# Altium schematic sheet KLZ.SchDoc
size A3
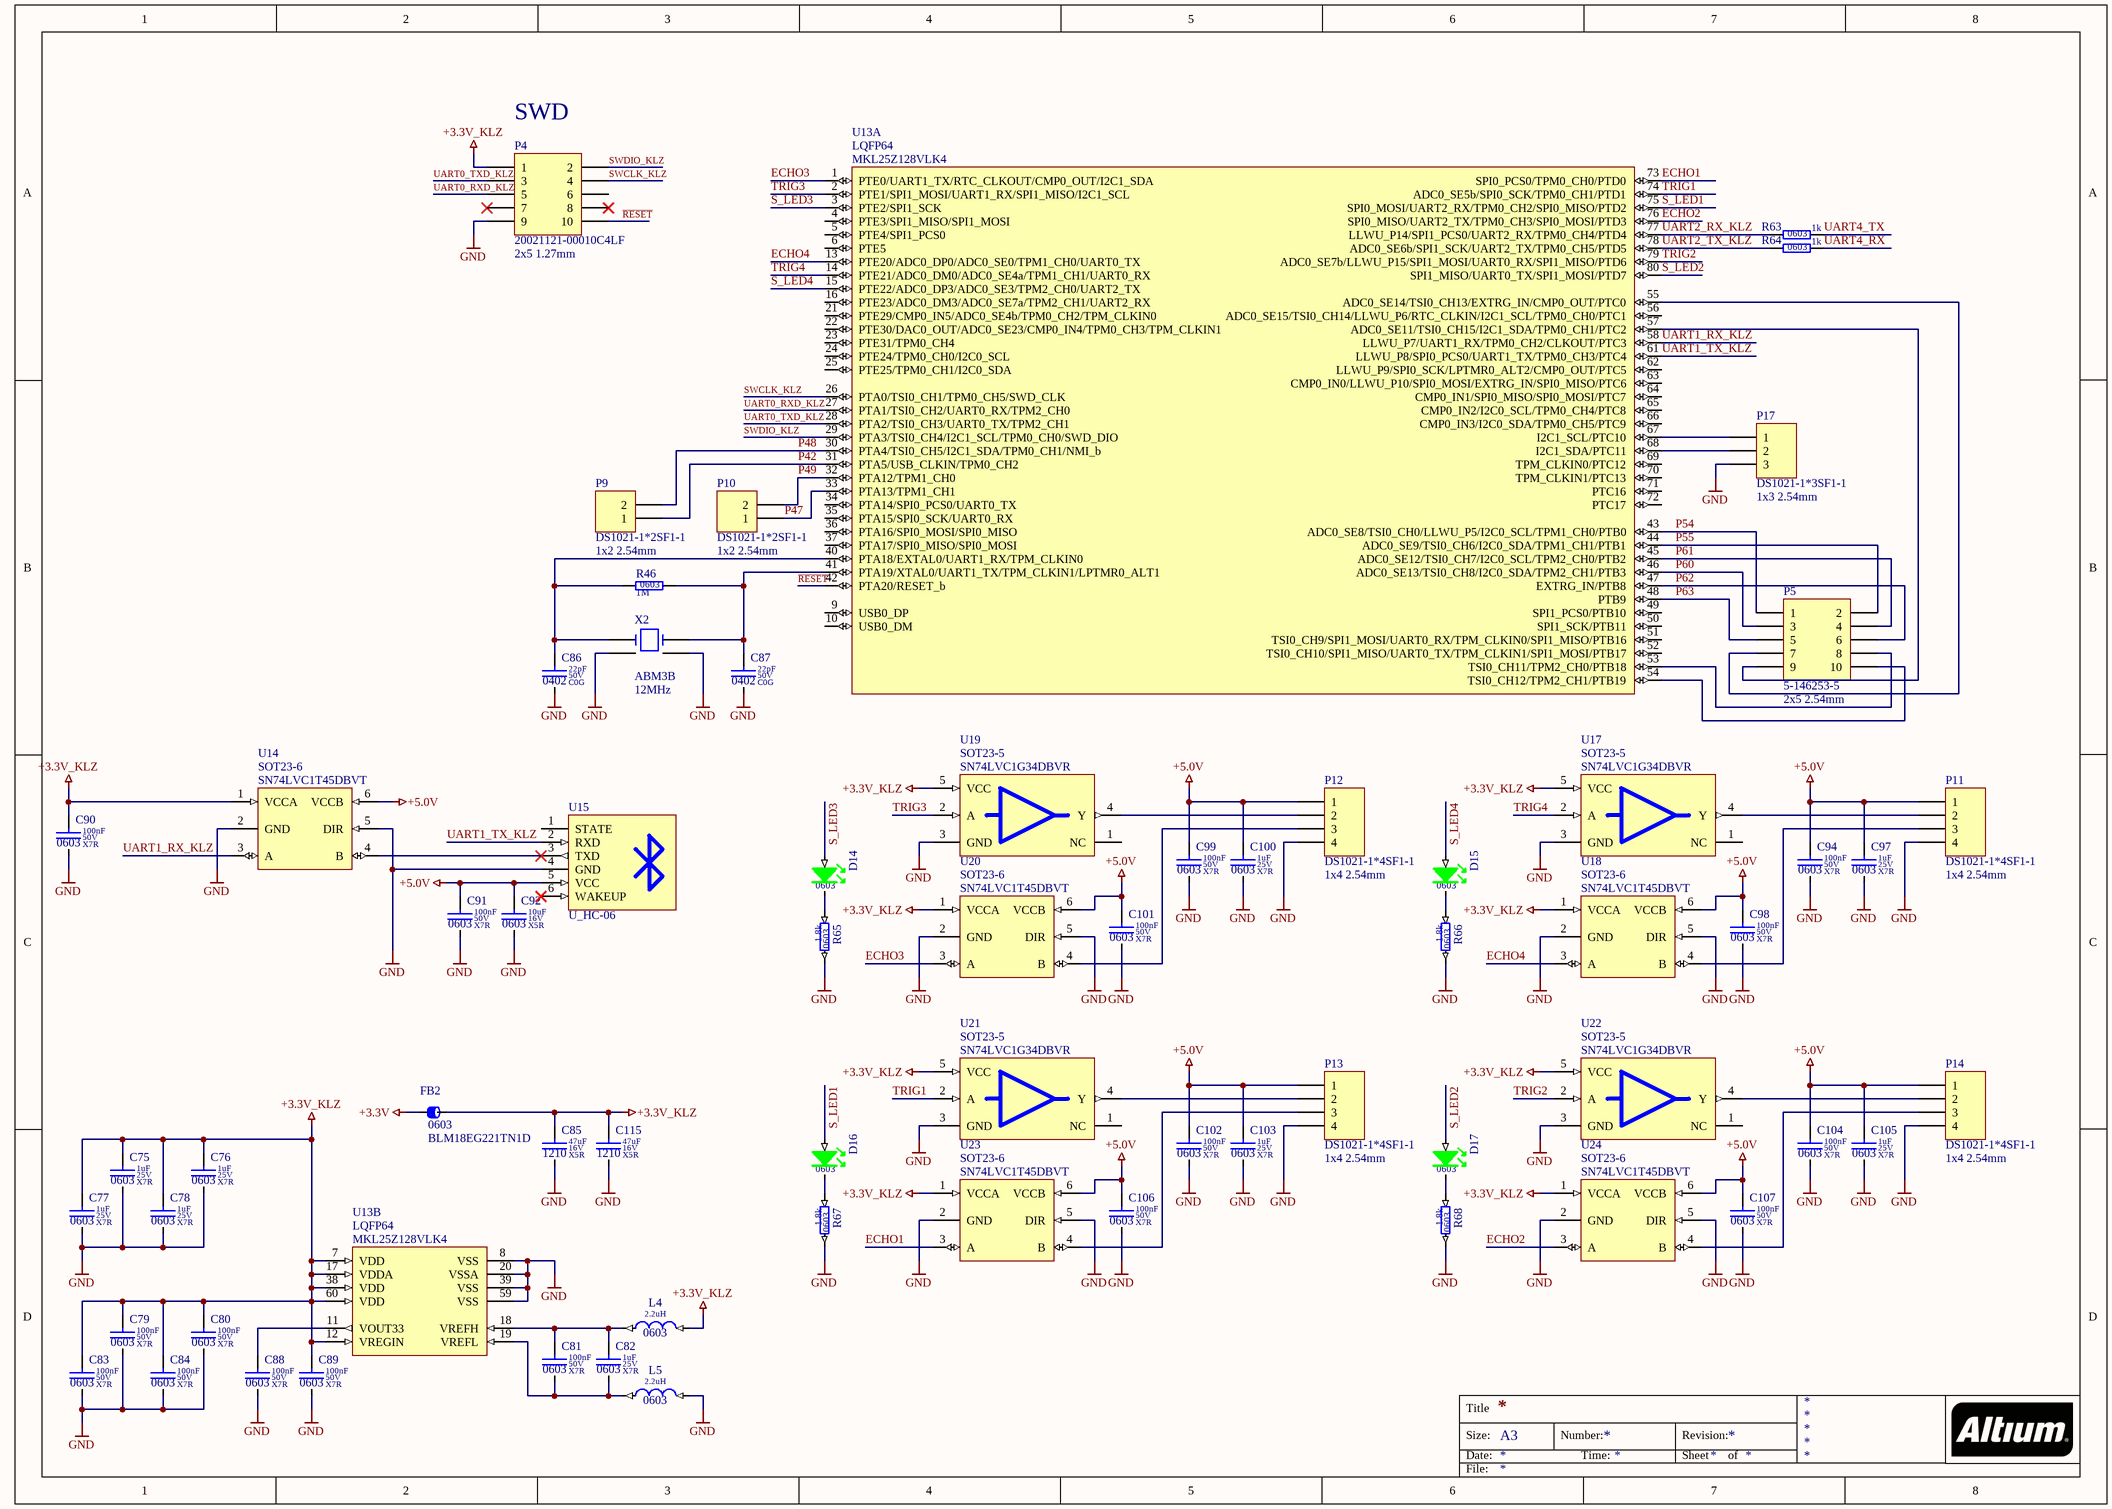
[diagram p0: KLZ.SchDoc]

## Parts
C75  value 1uF  Dielectric: X7R  Voltage: 25V  SCH_Footprint: 0603  [C_0603_1608]  (hidden comment: Ceramic X7R)
C76  value 1uF  Dielectric: X7R  Voltage: 25V  SCH_Footprint: 0603  [C_0603_1608]  (hidden comment: Ceramic X7R)
C77  value 1uF  Dielectric: X7R  Voltage: 25V  SCH_Footprint: 0603  [C_0603_1608]  (hidden comment: Ceramic X7R)
C78  value 1uF  Dielectric: X7R  Voltage: 25V  SCH_Footprint: 0603  [C_0603_1608]  (hidden comment: Ceramic X7R)
C79  value 100nF  Dielectric: X7R  Voltage: 50V  SCH_Footprint: 0603  [C_0603_1608]  (hidden comment: Ceramic X7R)
C80  value 100nF  Dielectric: X7R  Voltage: 50V  SCH_Footprint: 0603  [C_0603_1608]  (hidden comment: Ceramic X7R)
C81  value 100nF  Dielectric: X7R  Voltage: 50V  SCH_Footprint: 0603  [C_0603_1608]  (hidden comment: Ceramic X7R)
C82  value 1uF  Dielectric: X7R  Voltage: 25V  SCH_Footprint: 0603  [C_0603_1608]  (hidden comment: Ceramic X7R)
C83  value 100nF  Dielectric: X7R  Voltage: 50V  SCH_Footprint: 0603  [C_0603_1608]  (hidden comment: Ceramic X7R)
C84  value 100nF  Dielectric: X7R  Voltage: 50V  SCH_Footprint: 0603  [C_0603_1608]  (hidden comment: Ceramic X7R)
C85  value 47uF  Dielectric: X5R  Voltage: 16V  SCH_Footprint: 1210  [C_1210_3225]  (hidden comment: Ceramic X5R)
C86  value 22pF  Dielectric: C0G  Voltage: 50V  SCH_Footprint: 0402  [C_0402_1005]  (hidden comment: Ceramic C0G)
C87  value 22pF  Dielectric: C0G  Voltage: 50V  SCH_Footprint: 0402  [C_0402_1005]  (hidden comment: Ceramic C0G)
C88  value 100nF  Dielectric: X7R  Voltage: 50V  SCH_Footprint: 0603  [C_0603_1608]  (hidden comment: Ceramic X7R)
C89  value 100nF  Dielectric: X7R  Voltage: 50V  SCH_Footprint: 0603  [C_0603_1608]  (hidden comment: Ceramic X7R)
C90  value 100nF  Dielectric: X7R  Voltage: 50V  SCH_Footprint: 0603  [C_0603_1608]  (hidden comment: Ceramic X7R)
C91  value 100nF  Dielectric: X7R  Voltage: 50V  SCH_Footprint: 0603  [C_0603_1608]  (hidden comment: Ceramic X7R)
C92  value 10uF  Dielectric: X5R  Voltage: 16V  SCH_Footprint: 0603  [C_0603_1608]  (hidden comment: Ceramic X5R)
C94  value 100nF  Dielectric: X7R  Voltage: 50V  SCH_Footprint: 0603  [C_0603_1608]  (hidden comment: Ceramic X7R)
C97  value 1uF  Dielectric: X7R  Voltage: 25V  SCH_Footprint: 0603  [C_0603_1608]  (hidden comment: Ceramic X7R)
C98  value 100nF  Dielectric: X7R  Voltage: 50V  SCH_Footprint: 0603  [C_0603_1608]  (hidden comment: Ceramic X7R)
C99  value 100nF  Dielectric: X7R  Voltage: 50V  SCH_Footprint: 0603  [C_0603_1608]  (hidden comment: Ceramic X7R)
C100  value 1uF  Dielectric: X7R  Voltage: 25V  SCH_Footprint: 0603  [C_0603_1608]  (hidden comment: Ceramic X7R)
C101  value 100nF  Dielectric: X7R  Voltage: 50V  SCH_Footprint: 0603  [C_0603_1608]  (hidden comment: Ceramic X7R)
C102  value 100nF  Dielectric: X7R  Voltage: 50V  SCH_Footprint: 0603  [C_0603_1608]  (hidden comment: Ceramic X7R)
C103  value 1uF  Dielectric: X7R  Voltage: 25V  SCH_Footprint: 0603  [C_0603_1608]  (hidden comment: Ceramic X7R)
C104  value 100nF  Dielectric: X7R  Voltage: 50V  SCH_Footprint: 0603  [C_0603_1608]  (hidden comment: Ceramic X7R)
C105  value 1uF  Dielectric: X7R  Voltage: 25V  SCH_Footprint: 0603  [C_0603_1608]  (hidden comment: Ceramic X7R)
C106  value 100nF  Dielectric: X7R  Voltage: 50V  SCH_Footprint: 0603  [C_0603_1608]  (hidden comment: Ceramic X7R)
C107  value 100nF  Dielectric: X7R  Voltage: 50V  SCH_Footprint: 0603  [C_0603_1608]  (hidden comment: Ceramic X7R)
C115  value 47uF  Dielectric: X5R  Voltage: 16V  SCH_Footprint: 1210  [C_1210_3225]  (hidden comment: Ceramic X5R)
D14  SCH_Footprint: 0603  [OL_0603_1608]  (hidden comment: OL_G)
D15  SCH_Footprint: 0603  [OL_0603_1608]  (hidden comment: OL_G)
D16  SCH_Footprint: 0603  [OL_0603_1608]  (hidden comment: OL_G)
D17  SCH_Footprint: 0603  [OL_0603_1608]  (hidden comment: OL_G)
FB2  value BLM18EG221TN1D  SCH_Footprint: 0603  [FB_0603_1608]  (hidden comment: Ferrite bead)
L4  value 2.2uH  SCH_Footprint: 0603  [L_0603_1608]  (hidden comment: Inductor)
L5  value 2.2uH  SCH_Footprint: 0603  [L_0603_1608]  (hidden comment: Inductor)
P4  value 20021121-00010C4LF  SCH_Footprint: 2x5 1.27mm  [P_HEADER_2x5_1.27]  (hidden comment: Jtag)
P5  value 5-146253-5  SCH_Footprint: 2x5 2.54mm  [P_HEADER_2x5_2.54]  (hidden comment: Goldpin)
P9  value DS1021-1*2SF1-1  SCH_Footprint: 1x2 2.54mm  [P_HEADER_1x2_2.54]  (hidden comment: Goldpin)
P10  value DS1021-1*2SF1-1  SCH_Footprint: 1x2 2.54mm  [P_HEADER_1x2_2.54]  (hidden comment: Goldpin)
P11  value DS1021-1*4SF1-1  SCH_Footprint: 1x4 2.54mm  [P_HEADER_1x4_2.54]  (hidden comment: Goldpin)
P12  value DS1021-1*4SF1-1  SCH_Footprint: 1x4 2.54mm  [P_HEADER_1x4_2.54]  (hidden comment: Goldpin)
P13  value DS1021-1*4SF1-1  SCH_Footprint: 1x4 2.54mm  [P_HEADER_1x4_2.54]  (hidden comment: Goldpin)
P14  value DS1021-1*4SF1-1  SCH_Footprint: 1x4 2.54mm  [P_HEADER_1x4_2.54]  (hidden comment: Goldpin)
P17  value DS1021-1*3SF1-1  SCH_Footprint: 1x3 2.54mm  [P_HEADER_1x3_2.54]  (hidden comment: Goldpin)
R46  value 1M  SCH_Footprint: 0603  [R_0603_1608]  (hidden comment: Resistor)
R63  value 1k  SCH_Footprint: 0603  [R_0603_1608]  (hidden comment: Resistor)
R64  value 1k  SCH_Footprint: 0603  [R_0603_1608]  (hidden comment: Resistor)
R65  value 1.8k  SCH_Footprint: 0603  [R_0603_1608]  (hidden comment: Resistor)
R66  value 1.8k  SCH_Footprint: 0603  [R_0603_1608]  (hidden comment: Resistor)
R67  value 1.8k  SCH_Footprint: 0603  [R_0603_1608]  (hidden comment: Resistor)
R68  value 1.8k  SCH_Footprint: 0603  [R_0603_1608]  (hidden comment: Resistor)
U13  SCH_Footprint: LQFP64  [LQFP80_12x12]  (hidden comment: MKL25Z128VLK4)  (parts A,B of 2)
U14  value SN74LVC1T45DBVT  SCH_Footprint: SOT23-6  [SOT23-6_SC74A_SOT753]  (hidden comment: Single-Bit Dual-Supply Bus Transceiver)
U15  U_HC-06  [BT_HC-06]
U17  value SN74LVC1G34DBVR  SCH_Footprint: SOT23-5  [SOT23-5_SC74A_SOT753_M]  (hidden comment: Single Buffer Gate)
U18  value SN74LVC1T45DBVT  SCH_Footprint: SOT23-6  [SOT23-6_SC74A_SOT753]  (hidden comment: Single-Bit Dual-Supply Bus Transceiver)
U19  value SN74LVC1G34DBVR  SCH_Footprint: SOT23-5  [SOT23-5_SC74A_SOT753_M]  (hidden comment: Single Buffer Gate)
U20  value SN74LVC1T45DBVT  SCH_Footprint: SOT23-6  [SOT23-6_SC74A_SOT753]  (hidden comment: Single-Bit Dual-Supply Bus Transceiver)
U21  value SN74LVC1G34DBVR  SCH_Footprint: SOT23-5  [SOT23-5_SC74A_SOT753_M]  (hidden comment: Single Buffer Gate)
U22  value SN74LVC1G34DBVR  SCH_Footprint: SOT23-5  [SOT23-5_SC74A_SOT753_M]  (hidden comment: Single Buffer Gate)
U23  value SN74LVC1T45DBVT  SCH_Footprint: SOT23-6  [SOT23-6_SC74A_SOT753]  (hidden comment: Single-Bit Dual-Supply Bus Transceiver)
U24  value SN74LVC1T45DBVT  SCH_Footprint: SOT23-6  [SOT23-6_SC74A_SOT753]  (hidden comment: Single-Bit Dual-Supply Bus Transceiver)
X2  value 12MHz  SCH_Footprint: ABM3B  [X_ABM3B_5X3X11]  (hidden comment: X_ABM3B)

## Nets
+3.3V: FB2.1
+3.3V_KLZ: C75.1 C76.1 C77.1 C78.1 C79.1 C80.1 C83.1 C84.1 C85.1 C89.1 C90.1 C115.1 FB2.2 L4.1 P4.1 U13.7(VDD) U13.12(VREGIN) U13.17(VDDA) U13.38(VDD) U13.60(VDD) U14.1(VCCA) U17.5(VCC) U18.1(VCCA) U19.5(VCC) U20.1(VCCA) U21.5(VCC) U22.5(VCC) U23.1(VCCA) U24.1(VCCA)
+5.0V: C91.1 C92.1 C94.1 C97.1 C98.1 C99.1 C100.1 C101.1 C102.1 C103.1 C104.1 C105.1 C106.1 C107.1 P11.1 P12.1 P13.1 P14.1 U14.6(VCCB) U15.5(VCC) U18.6(VCCB) U20.6(VCCB) U23.6(VCCB) U24.6(VCCB)
GND: C75.2 C76.2 C77.2 C78.2 C79.2 C80.2 C83.2 C84.2 C85.2 C86.2 C87.2 C88.2 C89.2 C90.2 C91.2 C92.2 C94.2 C97.2 C98.2 C99.2 C100.2 C101.2 C102.2 C103.2 C104.2 C105.2 C106.2 C107.2 C115.2 L5.1 P4.9 P11.4 P12.4 P13.4 P14.4 P17.3 R65.2 R66.2 R67.2 R68.2 U13.8(VSS) U13.20(VSSA) U13.39(VSS) U13.59(VSS) U14.2(GND) U14.5(DIR) U15.4(GND) U17.3(GND) U18.2(GND) U18.5(DIR) U19.3(GND) U20.2(GND) U20.5(DIR) U21.3(GND) U22.3(GND) U23.2(GND) U23.5(DIR) U24.2(GND) U24.5(DIR) X2.2(GND) X2.4(GND)
ECHO1: U13.73(SPI0_PCS0/TPM0_CH0/PTD0) U23.3(A)
ECHO2: U13.76(SPI0_MISO/UART2_TX/TPM0_CH3/SPI0_MOSI/PTD3) U24.3(A)
ECHO3: U13.1(PTE0/UART1_TX/RTC_CLKOUT/CMP0_OUT/I2C1_SDA) U20.3(A)
ECHO4: U13.13(PTE20/ADC0_DP0/ADC0_SE0/TPM1_CH0/UART0_TX) U18.3(A)
P42: P9.1 U13.31(PTA5/USB_CLKIN/TPM0_CH2)
P47: P10.1 U13.33(PTA13/TPM1_CH1)
P48: P9.2 U13.30(PTA4/TSI0_CH5/I2C1_SDA/TPM0_CH1/NMI_b)
P49: P10.2 U13.32(PTA12/TPM1_CH0)
P54: P5.1 U13.43(ADC0_SE8/TSI0_CH0/LLWU_P5/I2C0_SCL/TPM1_CH0/PTB0)
P55: P5.2 U13.44(ADC0_SE9/TSI0_CH6/I2C0_SDA/TPM1_CH1/PTB1)
P60: P5.3 U13.46(ADC0_SE13/TSI0_CH8/I2C0_SDA/TPM2_CH1/PTB3)
P61: P5.4 U13.45(ADC0_SE12/TSI0_CH7/I2C0_SCL/TPM2_CH0/PTB2)
P62: P5.6 U13.47(EXTRG_IN/PTB8)
P63: P5.5 U13.48(PTB9)
~{RESET}: P4.10 U13.42(PTA20/RESET_b)
S_LED1: D16.2(A) U13.75(SPI0_MOSI/UART2_RX/TPM0_CH2/SPI0_MISO/PTD2)
S_LED2: D17.2(A) U13.80(SPI1_MISO/UART0_TX/SPI1_MOSI/PTD7)
S_LED3: D14.2(A) U13.3(PTE2/SPI1_SCK)
S_LED4: D15.2(A) U13.15(PTE22/ADC0_DP3/ADC0_SE3/TPM2_CH0/UART2_TX)
SWCLK_KLZ: P4.4 U13.26(PTA0/TSI0_CH1/TPM0_CH5/SWD_CLK)
SWDIO_KLZ: P4.2 U13.29(PTA3/TSI0_CH4/I2C1_SCL/TPM0_CH0/SWD_DIO)
TRIG1: U13.74(ADC0_SE5b/SPI0_SCK/TPM0_CH1/PTD1) U21.2(A)
TRIG2: U13.79(ADC0_SE7b/LLWU_P15/SPI1_MOSI/UART0_RX/SPI1_MISO/PTD6) U22.2(A)
TRIG3: U13.2(PTE1/SPI1_MOSI/UART1_RX/SPI1_MISO/I2C1_SCL) U19.2(A)
TRIG4: U13.14(PTE21/ADC0_DM0/ADC0_SE4a/TPM1_CH1/UART0_RX) U17.2(A)
UART0_RXD_KLZ: P4.5 U13.27(PTA1/TSI0_CH2/UART0_RX/TPM2_CH0)
UART0_TXD_KLZ: P4.3 U13.28(PTA2/TSI0_CH3/UART0_TX/TPM2_CH1)
UART1_RX_KLZ: U13.58(LLWU_P7/UART1_RX/TPM0_CH2/CLKOUT/PTC3) U14.3(A)
UART1_TX_KLZ: U13.61(LLWU_P8/SPI0_PCS0/UART1_TX/TPM0_CH3/PTC4) U15.2(RXD)
UART2_RX_KLZ: R63.1 U13.77(LLWU_P14/SPI1_PCS0/UART2_RX/TPM0_CH4/PTD4)
UART2_TX_KLZ: R64.1 U13.78(ADC0_SE6b/SPI1_SCK/UART2_TX/TPM0_CH5/PTD5)
UART4_RX: R64.2
UART4_TX: R63.2
NetC81_1: C81.1 C82.1 L4.2 U13.18(VREFH)
NetC81_2: C81.2 C82.2 L5.2 U13.19(VREFL)
NetC86_1: C86.1 R46.1 U13.40(PTA18/EXTAL0/UART1_RX/TPM_CLKIN0) X2.3
NetC87_1: C87.1 R46.2 U13.41(PTA19/XTAL0/UART1_TX/TPM_CLKIN1/LPTMR0_ALT1) X2.1
NetC88_1: C88.1 U13.11(VOUT33)
NetD14_1: D14.1(K) R65.1
NetD15_1: D15.1(K) R66.1
NetD16_1: D16.1(K) R67.1
NetD17_1: D17.1(K) R68.1
NetP5_7: P5.7 U13.55(ADC0_SE14/TSI0_CH13/EXTRG_IN/CMP0_OUT/PTC0)
NetP5_8: P5.8 U13.53(TSI0_CH11/TPM2_CH0/PTB18)
NetP5_9: P5.9 U13.57(ADC0_SE11/TSI0_CH15/I2C1_SDA/TPM0_CH1/PTC2)
NetP5_10: P5.10 U13.54(TSI0_CH12/TPM2_CH1/PTB19)
NetP11_2: P11.2 U17.4(Y)
NetP11_3: P11.3 U18.4(B)
NetP12_2: P12.2 U19.4(Y)
NetP12_3: P12.3 U20.4(B)
NetP13_2: P13.2 U21.4(Y)
NetP13_3: P13.3 U23.4(B)
NetP14_2: P14.2 U22.4(Y)
NetP14_3: P14.3 U24.4(B)
NetP17_1: P17.1 U13.67(I2C1_SCL/PTC10)
NetP17_2: P17.2 U13.68(I2C1_SDA/PTC11)
NetU14_4: U14.4(B) U15.3(TXD)

Not connected (* = marked no-connect by the designer): P4 6 7* 8*; U13 4(PTE3/SPI1_MISO/SPI1_MOSI) 5(PTE4/SPI1_PCS0) 6(PTE5) 9(USB0_DP) 10(USB0_DM) 16(PTE23/ADC0_DM3/ADC0_SE7a/TPM2_CH1/UART2_RX) 21(PTE29/CMP0_IN5/ADC0_SE4b/TPM0_CH2/TPM_CLKIN0) 22(PTE30/DAC0_OUT/ADC0_SE23/CMP0_IN4/TPM0_CH3/TPM_CLKIN1) 23(PTE31/TPM0_CH4) 24(PTE24/TPM0_CH0/I2C0_SCL) 25(PTE25/TPM0_CH1/I2C0_SDA) 34(PTA14/SPI0_PCS0/UART0_TX) 35(PTA15/SPI0_SCK/UART0_RX) 36(PTA16/SPI0_MOSI/SPI0_MISO) 37(PTA17/SPI0_MISO/SPI0_MOSI) 49(SPI1_PCS0/PTB10) 50(SPI1_SCK/PTB11) 51(TSI0_CH9/SPI1_MOSI/UART0_RX/TPM_CLKIN0/SPI1_MISO/PTB16) 52(TSI0_CH10/SPI1_MISO/UART0_TX/TPM_CLKIN1/SPI1_MOSI/PTB17) 56(ADC0_SE15/TSI0_CH14/LLWU_P6/RTC_CLKIN/I2C1_SCL/TPM0_CH0/PTC1) 62(LLWU_P9/SPI0_SCK/LPTMR0_ALT2/CMP0_OUT/PTC5) 63(CMP0_IN0/LLWU_P10/SPI0_MOSI/EXTRG_IN/SPI0_MISO/PTC6) 64(CMP0_IN1/SPI0_MISO/SPI0_MOSI/PTC7) 65(CMP0_IN2/I2C0_SCL/TPM0_CH4/PTC8) 66(CMP0_IN3/I2C0_SDA/TPM0_CH5/PTC9) 69(TPM_CLKIN0/PTC12) 70(TPM_CLKIN1/PTC13) 71(PTC16) 72(PTC17); U15 1(STATE) 6(WAKEUP)*; U17 1(NC); U19 1(NC); U21 1(NC); U22 1(NC)

## Notes on the sheet
- (near P4) SWD
- Title
- Size:
- Date:
- A3
- Number:
- Time:
- Revision:
- Sheet
- of
- File:

## Library data of the parts
C75-C78 C82 C97 C100 C103 C105 = C_1uF_25V_X7R_0603_10: Capacitor; Manufacturer: Samsung; Manufacturer Part Number: CL10B105KA8NNNC; Tolerance (%): 10; Part Number: C_1uF_25V_X7R_0603_10; HelpURL: http://www.tme.eu/pl/Document/4a42202b32dab16128fe107dd69598cc/samsung-chip-cap.pdf; Supplier 1: TME; Supplier Part Number 1: CL10B105KA8NNNC; Supplier 2: RS Components; Supplier 3: Farnell; Supplier 4: Mouser; Supplier 5: Digi-Key
C79-C81 C83 C84 C88-C91 C94 C98 C99 C101 C102 C104 C106 C107 = C_100nF_50V_X7R_0603_5: Capacitor; Manufacturer: Samsung; Manufacturer Part Number: CL10B104JB8NNNC; Tolerance (%): 5; Part Number: C_100nF_50V_X7R_0603_5; HelpURL: http://www.tme.eu/pl/Document/4a42202b32dab16128fe107dd69598cc/samsung-chip-cap.pdf; Supplier 1: TME; Supplier Part Number 1: CL10B104JB8NNNC; Supplier 2: RS Components; Supplier 3: Farnell; Supplier 4: Mouser; Supplier 5: Digi-Key
C85 C115 = C_47uF_16V_X5R_1210_10: Capacitor; Manufacturer: Samsung; Manufacturer Part Number: CL32A476KOJNNNE; Tolerance (%): 10; Part Number: C_47uF_16V_X5R_1210_10; HelpURL: http://www.samsungsem.com/kr/support/product-search/mlcc/__icsFiles/afieldfile/2018/06/21/CL32A476KOJNNNE.pdf; Supplier 1: TME; Supplier 2: RS Components; Supplier 3: Farnell; Supplier 4: Mouser; Supplier 5: Digi-Key; Supplier Part Number 5: 1276-3376-1-ND
C86 C87 = C_22pF_50V_C0G_0402_5: Capacitor; Manufacturer: AVX; Manufacturer Part Number: 04025A220JAT2A; Tolerance (%): 5; Part Number: C_22pF_50V_C0G_0402_5; HelpURL: http://datasheet.octopart.com/04025A220JAT2A-AVX-datasheet-9883399.pdf; Supplier 1: TME; Supplier Part Number 1: 04025A220JAT2A; Supplier 2: RS Components; Supplier Part Number 2: 6983087; Supplier 3: Farnell; Supplier Part Number 3: 2280776; Supplier 4: Mouser; Supplier Part Number 4: 581-04025A220J; Supplier 5: Digi-Key; Supplier Part Number 5: 478-1074-1-ND
C92 = C_10uF_16V_X5R_0603_20: Capacitor; Manufacturer: Samsung Electro-Mechanics; Manufacturer Part Number: CL10A106MO8NQNC; Tolerance (%): 20; Part Number: C_10uF_16V_X5R_0603_20; HelpURL: http://www.tme.eu/pl/Document/4a42202b32dab16128fe107dd69598cc/samsung-chip-cap.pdf; Supplier 1: TME; Supplier Part Number 1: CL10A106MO8NQNC; Supplier 2: RS Components; Supplier 3: Farnell; Supplier 4: Mouser; Supplier 5: Digi-Key
D14-D17 = OL_G_0603_0C06_APG1608CGKC/T: LED GREEN; Part Number: OL_G_0603_0C06_APG1608CGKC/T; Supplier 1: TME; Supplier 2: RS Components; Supplier 3: Farnell; Supplier 4: Mouser; Supplier 5: Digi-Key; Supplier Part Number 5: 754-1357-1-ND
FB2 = FB_BLM18EG221TN1D: Manufacturer: Murata; Current: 1A; Resistance: 150mR; Part Number: FB_BLM18EG221TN1D; HelpURL: http://datasheet.octopart.com/BLM18EG221TN1D-Murata-datasheet-66919.pdf; Manufacturer Part Number: BLM18EG221TN1D; Supplier 1: TME; Supplier 2: RS Components; Supplier Part Number 2: 7926243P; Supplier 3: Farnell; Supplier Part Number 3: 1515717; Supplier 4: Mouser; Supplier Part Number 4: 81-BLM18EG221TN1D; Supplier 5: Digi-Key; Supplier Part Number 5: 490-5979-1-ND
L4 L5 = L_2.2uH_130mA_0603: Induction; Manufacturer: TDK; Manufacturer Part Number: MLZ1608A2R2WT000; Current: 130mA; Resistance: 250mR; Part Number: L_2.2uH_130mA_0603; HelpURL: http://datasheet.octopart.com/MLZ1608A2R2WT000-TDK-datasheet-38159369.pdf; Supplier 1: TME; Supplier 2: RS Components; Supplier 3: Farnell; Supplier Part Number 3: 2215629; Supplier 4: Mouser; Supplier Part Number 4: 810-MLZ1608A2R2WT000; Supplier 5: Digi-Key; Supplier Part Number 5: 445-6385-1-ND
P4 = P_HEADER_2x5_1.27: Header, 10-Pin, Dual row; Manufacturer: FCI; Part Number: P_HEADER_2x5_1.27; Component Type: Standard; HelpURL: http://www.mouser.com/catalog/645/usd/1591.pdf; Manufacturer Part Number: 20021121-00010C4LF; Supplier 1: TME; Supplier 2: RS Components; Supplier 3: Farnell; Supplier 4: Mouser; Supplier 5: Digi-Key
P5 = P_HEADER_2x5_2.54: Header, 10-Pin, Dual row; Manufacturer: TE Connectivity; Part Number: P_HEADER_2x5_2.54; Component Type: Standard; HelpURL: https://sigma.octopart.com/11631052/technical_drawing/TE-Connectivity-5-146253-5.pdf; Manufacturer Part Number: 5-146253-5; Supplier 1: TME; Supplier 2: RS Components; Supplier Part Number 2: 782-9205; Supplier 3: Farnell; Supplier Part Number 3: 2311131; Supplier 4: Mouser; Supplier Part Number 4: 571-5-146253-5; Supplier 5: Digi-Key; Supplier Part Number 5: A121461-ND
P9 P10 = P_HEADER_1x2_2.54: Header, 2-Pin; Manufacturer: Connfly; Part Number: P_HEADER_1x2_2.54; Component Type: Standard; HelpURL: http://www.tme.eu/en/Document/cc301e58a5da78cb543a94b5a5b7f06a/DS1021.pdf; Manufacturer Part Number: DS1021-1*2SF1-1; Supplier 1: TME; Supplier Part Number 1: ZL201-02G; Supplier 2: RS Components; Supplier 3: Farnell; Supplier 4: Mouser; Supplier 5: Digi-Key
P11-P14 = P_HEADER_1x4_2.54: Header, 4-Pin; Manufacturer: Connfly; Part Number: P_HEADER_1x4_2.54; Component Type: Standard; HelpURL: http://datasheet.octopart.com/DS1021-1%2A4SF1-1-Connfly-datasheet-65537859.pdf; Manufacturer Part Number: DS1021-1*4SF1-1; Supplier 1: TME; Supplier Part Number 1: ZL201-04G; Supplier 2: RS Components; Supplier 3: Farnell; Supplier 4: Mouser; Supplier 5: Digi-Key
P17 = P_HEADER_1x3_2.54: Header, 3-Pin; Manufacturer: Connfly; Part Number: P_HEADER_1x3_2.54; Component Type: Standard; HelpURL: http://www.tme.eu/en/Document/cc301e58a5da78cb543a94b5a5b7f06a/DS1021.pdf; Manufacturer Part Number: DS1021-1*3SF1-1; Supplier 1: TME; Supplier Part Number 1: ZL201-03G; Supplier 2: RS Components; Supplier 3: Farnell; Supplier 4: Mouser; Supplier 5: Digi-Key
R46 = R_1M_0603_1: Manufacturer: Bourns; Manufacturer Part Number: CR0603-FX-1004ELF; Voltage: 50V; Power: 100mW; Tolerance: 1%; Part Number: R_1M_0603_1; HelpURL: https://datasheet.octopart.com/CR0603-FX-1004ELF-Bourns-datasheet-5318152.pdf; Supplier 1: TME; Supplier 2: RS Components; Supplier 3: Farnell; Supplier Part Number 3: 2321755; Supplier 4: Mouser; Supplier Part Number 4: 652-CR0603FX-1004ELF; Supplier 5: Digi-Key; Supplier Part Number 5: CR0603-FX-1004ELFCT-ND
R63 R64 = R_1k_0603_1: Manufacturer: Vishay; Manufacturer Part Number: CRCW06031K00FKEA; Voltage: 75V; Power: 100mW; Tolerance: 1%; Part Number: R_1k_0603_1; HelpURL: http://www.farnell.com/datasheets/2310790.pdf?_ga=2.256888843.1690599162.1548417389-1379097396.1542296996&_gac=1.262631934.1547230258.Cj0KCQiAmuHhBRD0ARIsAFWyPwhX8HcvXnM3tA0ZBodZLzDIjH2ZxLpjT5LWo9bad_HPRbU8LfPq44UaAhEwEALw_wcB; Supplier 1: TME; Supplier 2: RS Components; Supplier Part Number 2: 678-9875P; Supplier 3: Farnell; Supplier Part Number 3: 1469740; Supplier 4: Mouser; Supplier Part Number 4: 71-CRCW0603-1.0K-E3; Supplier 5: Digi-Key; Supplier Part Number 5: 541-1.00KHCT-ND
R65-R68 = R_1.8k_0603_1: Manufacturer: Vishay; Manufacturer Part Number: CRCW06031K80FKTABC; Voltage: 75V; Power: 100mW; Tolerance: 1%; Part Number: R_1.8k_0603_1; HelpURL: https://www.tme.eu/pl/Document/622e28308c06d160637f2b14751ba16b/Data%20Sheet%20CRCW_BCe3.pdf; Supplier 1: TME; Supplier Part Number 1: CRCW06031K80FKTABC; Supplier 2: RS Components; Supplier 3: Farnell; Supplier 4: Mouser; Supplier 5: Digi-Key
U13 = U_MKL25Z128VLK4: Manufacturer: NXP; Value: MKL25Z128VLK4; Part Number: U_MKL25Z128VLK4; HelpURL: https://www.nxp.com/docs/en/data-sheet/KL25P80M48SF0.pdf; Manufacturer Part Number: MKL25Z128VLK4; Supplier 1: TME; Supplier 2: RS Components; Supplier Part Number 2: 7716881P; Supplier 3: Farnell; Supplier Part Number 3: 2212797; Supplier 4: Mouser; Supplier Part Number 4: 841-MKL25Z128VLK4; Supplier 5: Digi-Key; Supplier Part Number 5: MKL25Z128VLK4-ND
U14 U18 U20 U23 U24 = U_SN74LVC1T45DBVT: This single-bit noninverting bus transceiver uses two separate configurable power-supply rails.  VCCA and VCCB accepts any supply voltage from 1.65 V to 5.5 V. DIR low B->A, DIR high A->B; Manufacturer: Texas Instruments; Part Number: U_SN74LVC1T45DBVT; HelpURL: http://www.ti.com/lit/ds/symlink/sn74lvc1t45.pdf; Manufacturer Part Number: SN74LVC1T45DBVT; Supplier 1: TME; Supplier Part Number 1: SN74LVC1T45DBVT; Supplier 2: RS Components; Supplier Part Number 2: 6628825P; Supplier 3: Farnell; Supplier Part Number 3: 1470916; Supplier 4: Mouser; Supplier Part Number 4: 595-SN74LVC1T45DBVT; Supplier 5: Digi-Key; Supplier Part Number 5: 296-30381-1-ND
U17 U19 U21 U22 = U_SN74LVC1G34_DBV_DCK_DRL: Manufacturer: Texas Instruments; Part Number: U_SN74LVC1G34_DBV_DCK_DRL; HelpURL: http://www.ti.com/lit/ds/symlink/sn74lvc1g34.pdf; Manufacturer Part Number: SN74LVC1G34DBVR; Supplier 1: TME; Supplier Part Number 1: SN74LVC1G34DBVR; Supplier 2: RS Components; Supplier Part Number 2: 662-8774; Supplier 3: Farnell; Supplier Part Number 3: 2134094; Supplier 4: Mouser; Supplier Part Number 4: 595-SN74LVC1G34DBVR; Supplier 5: Digi-Key; Supplier Part Number 5: 296-17893-1-ND
X2 = X_12M8HZ_ABM3B: Part Number: X_12M8HZ_ABM3B; Supplier 1: TME; Supplier 2: RS Components; Supplier 3: Farnell; Supplier 4: Mouser; Supplier Part Number 4: 815-ABM3B-12.8-T; Supplier 5: Digi-Key; Supplier Part Number 5: 300-8199-1-ND